# EAGLE design Tach-to-CAN (EAGLE 9.5.1)
COMPANY_HQ: BUFFALO, NY; COMPANY_NAME: PROJECTMX5; PROJECT: MAZDA MIATA TACH TO CAN; SCH_REV: A
Assembly variants: Production

## Sheet 1 of 5: TACHOMETER ISOLATION
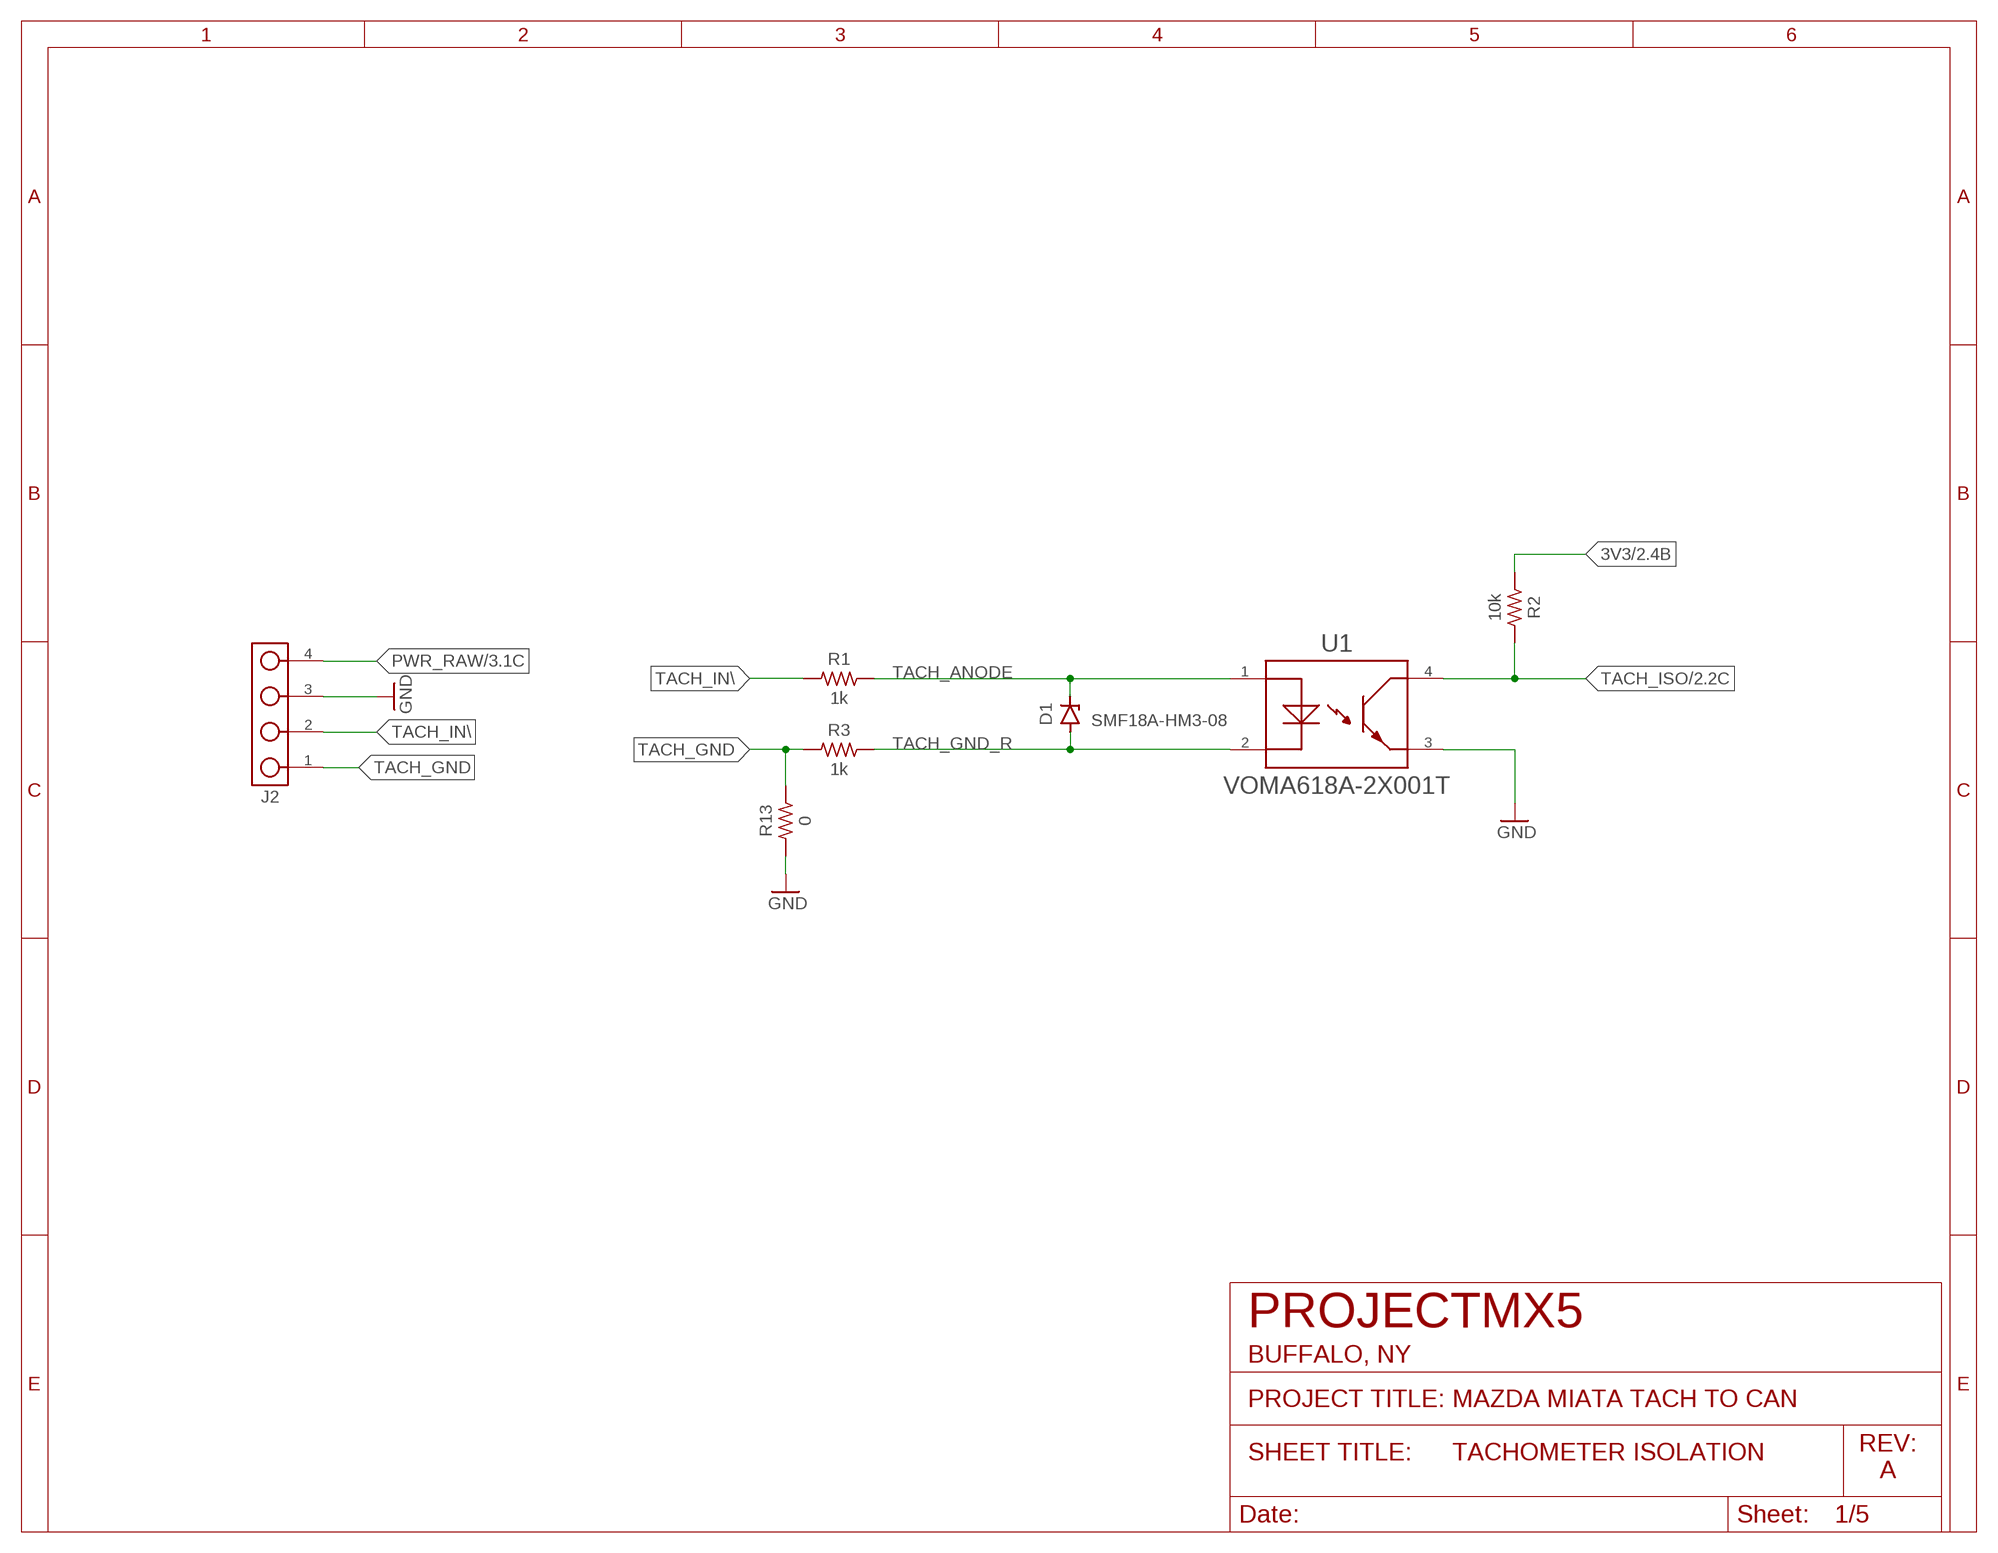
[diagram p0: schematic, sheet 1]

### Parts
D1  VISHAY_SMF18A-HM3-08  [VISHAY_SMFXXA-HM3-08]
J2  CONN_4PIN_VERT  [CONN_100MIL_4_PIN]
R1  1k  1KOHM-0603-1%-1/10W  [REST-0603]
R2  10k  10KOHM-0603-1%-1/10W  [REST-0603]
R3  1k  1KOHM-0603-1%-1/10W  [REST-0603]
R13  0  0OHM-0603-1%-1/10W  [REST-0603]
U1  VISHAY_VOMA618A-2X001T  [VISHAY_SOP-4]

### Nets
3V3: R2.1 ; also sheet 2,3,4,5
GND: J2.3 R13.1 U1.3 ; also sheet 2,3,4,5
PWR_RAW: J2.4 ; also sheet 3,5
TACH_ANODE: D1.C R1.2 U1.1
TACH_GND: J2.1 R3.1 R13.2
TACH_GND_R: D1.A R3.2 U1.2
TACH_IN\: J2.2 R1.1
TACH_ISO: R2.2 U1.4 ; also sheet 2

## Sheet 2 of 5: SIGNAL CONDITIONING
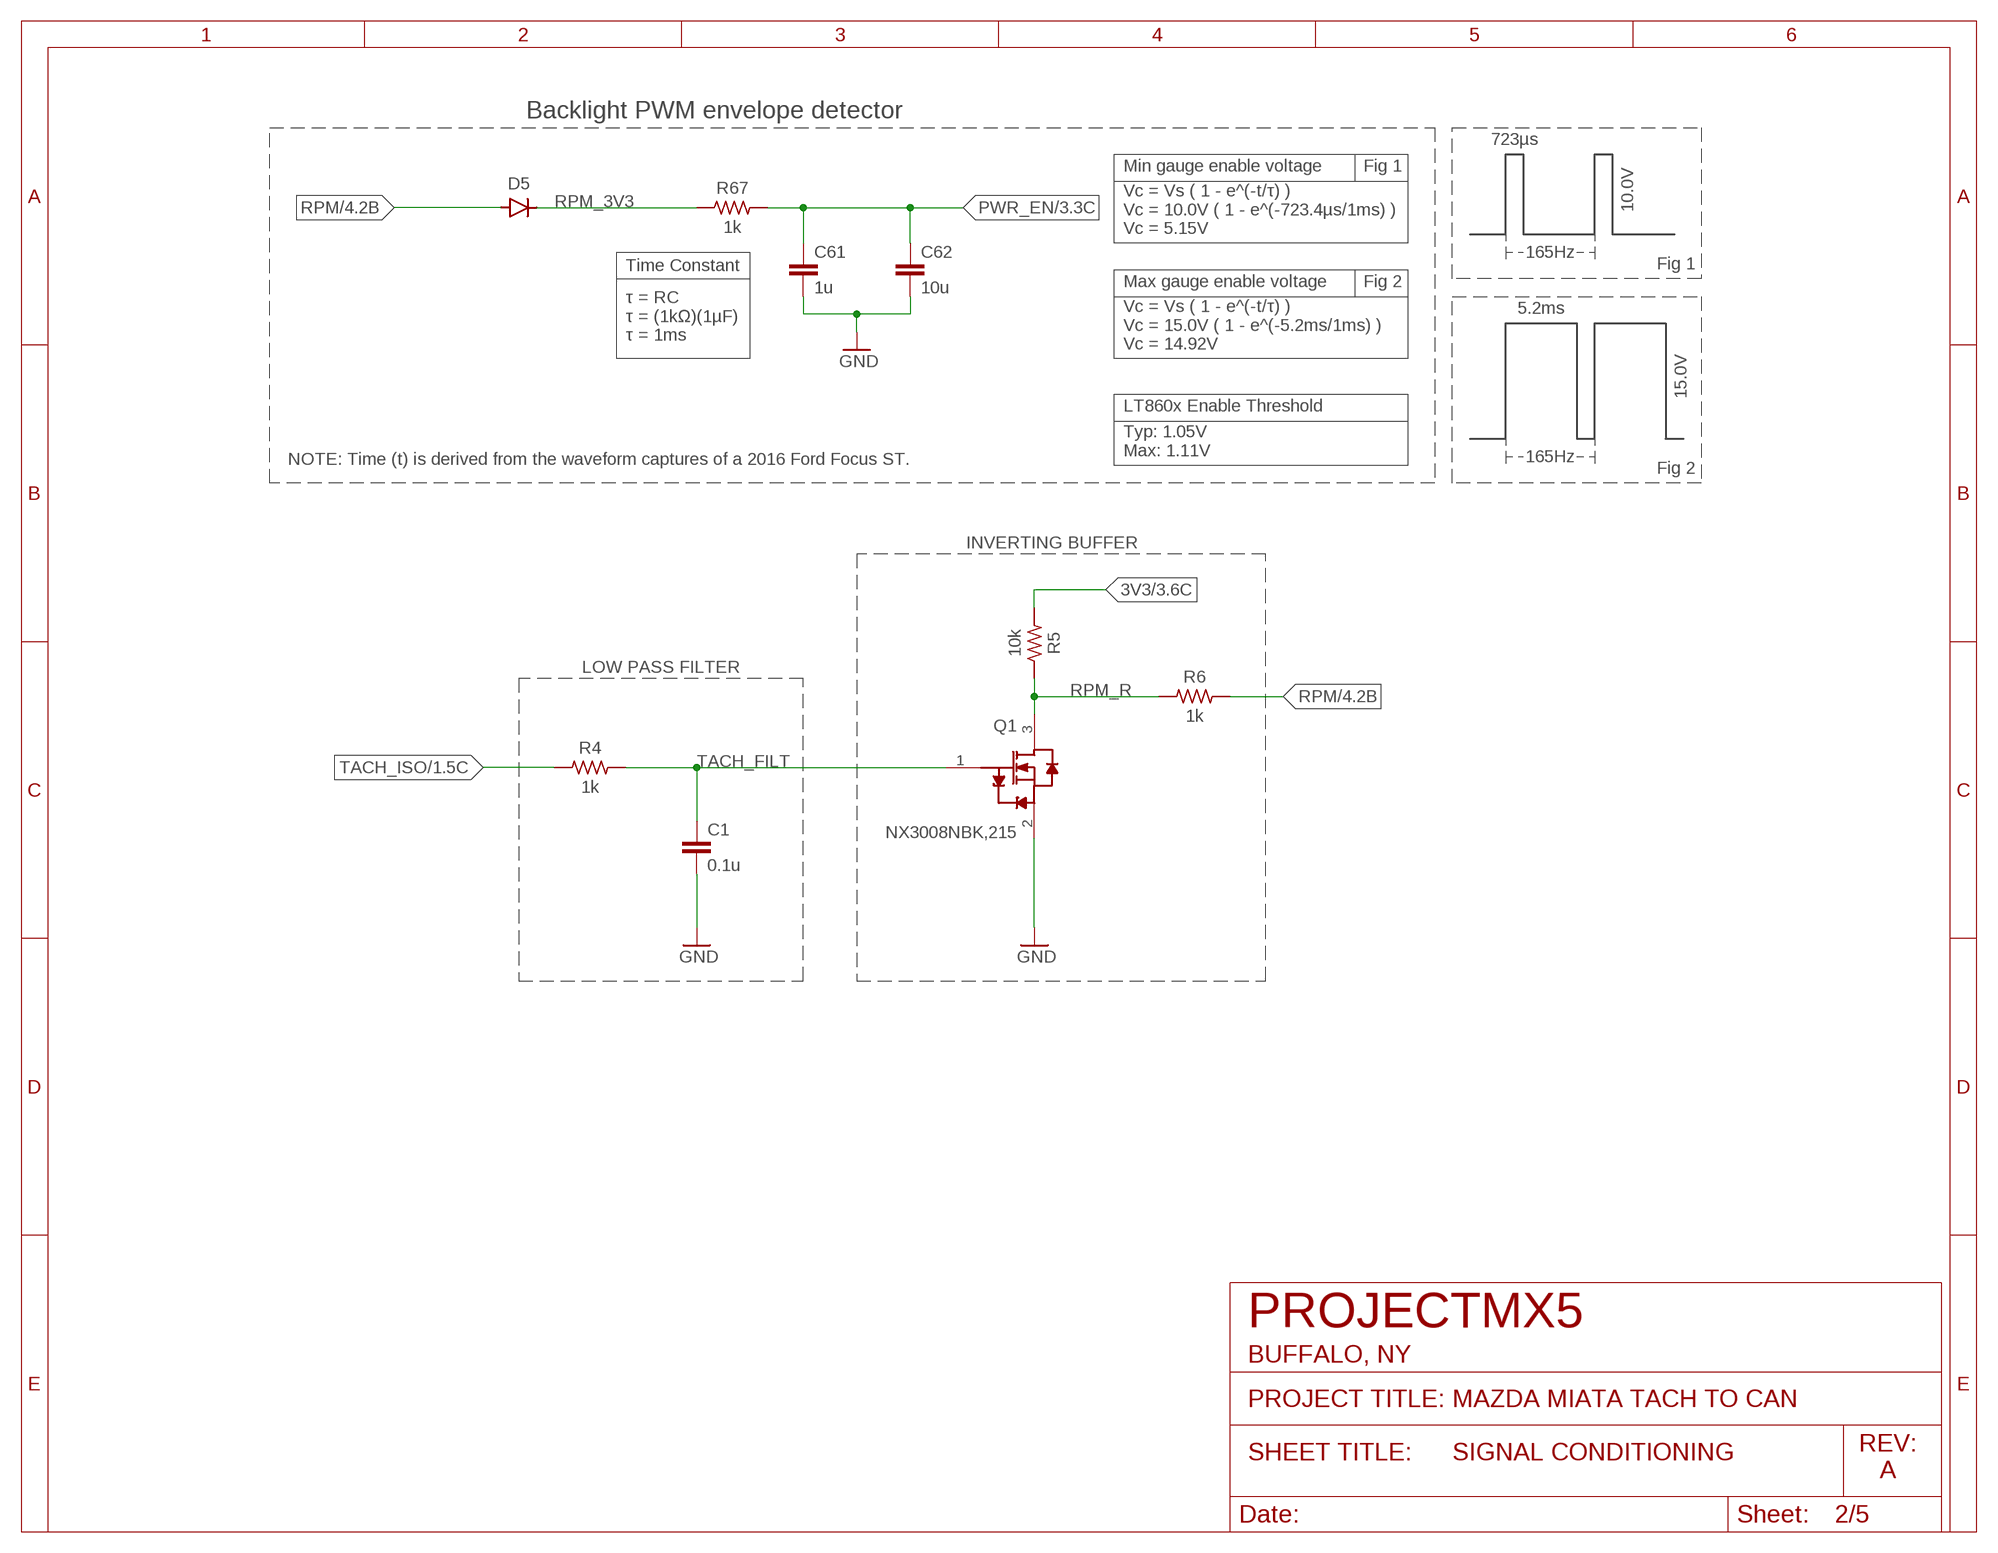
[diagram p1: schematic, sheet 2]

### Parts
C1  0.1u  0.1UF-X7R-50V-20%  [CAP-0603]
C61  1u  1UF-X7R-50V-10%  [CAP-0805]
C62  10u  10UF-X7R-50V-10%  [CAP-1206]  (not fitted in variant Production)
D5  AVX_SD1206S040S2R0  [AVX_SD1206S040S2R0]
Q1  NXP_NX3008NBK,215NXP_SOT23  [NXP_SOT23]
R4  1k  1KOHM-0603-1%-1/10W  [REST-0603]
R5  10k  10KOHM-0603-1%-1/10W  [REST-0603]
R6  1k  1KOHM-0603-1%-1/10W  [REST-0603]
R67  1k  1KOHM-0603-1%-1/10W  [REST-0603]

### Nets
3V3: R5.1 ; also sheet 1,3,4,5
GND: C1.2 C61.2 C62.2 Q1.2(S) ; also sheet 1,3,4,5
PWR_EN: C61.1 C62.1 R67.2 ; also sheet 3
RPM: D5.A R6.2 ; also sheet 4
RPM_3V3: D5.C R67.1
RPM_R: Q1.3(D) R5.2 R6.1
TACH_FILT: C1.1 Q1.1(G) R4.2
TACH_ISO: R4.1 ; also sheet 1

### Notes on the sheet
- Backlight PWM envelope detector
- 723µs
- Min gauge enable voltage | Fig 1
- 10.0V
- Vc = Vs ( 1 - e^(-t/τ) )
  Vc = 10.0V ( 1 - e^(-723.4µs/1ms) )
  Vc = 5.15V
- 165Hz
- Time Constant | Fig 1
- Max gauge enable voltage | Fig 2
- 5.2ms
- τ = RC
  τ = (1kΩ)(1µF)
  τ = 1ms
- Vc = Vs ( 1 - e^(-t/τ) )
  Vc = 15.0V ( 1 - e^(-5.2ms/1ms) )
  Vc = 14.92V
- 15.0V
- LT860x Enable Threshold
- Typ: 1.05V
  Max: 1.11V
- 165Hz
- NOTE: Time (t) is derived from the waveform captures of a 2016 Ford Focus ST.
- Fig 2
- INVERTING BUFFER
- LOW PASS FILTER

## Sheet 3 of 5: POWER
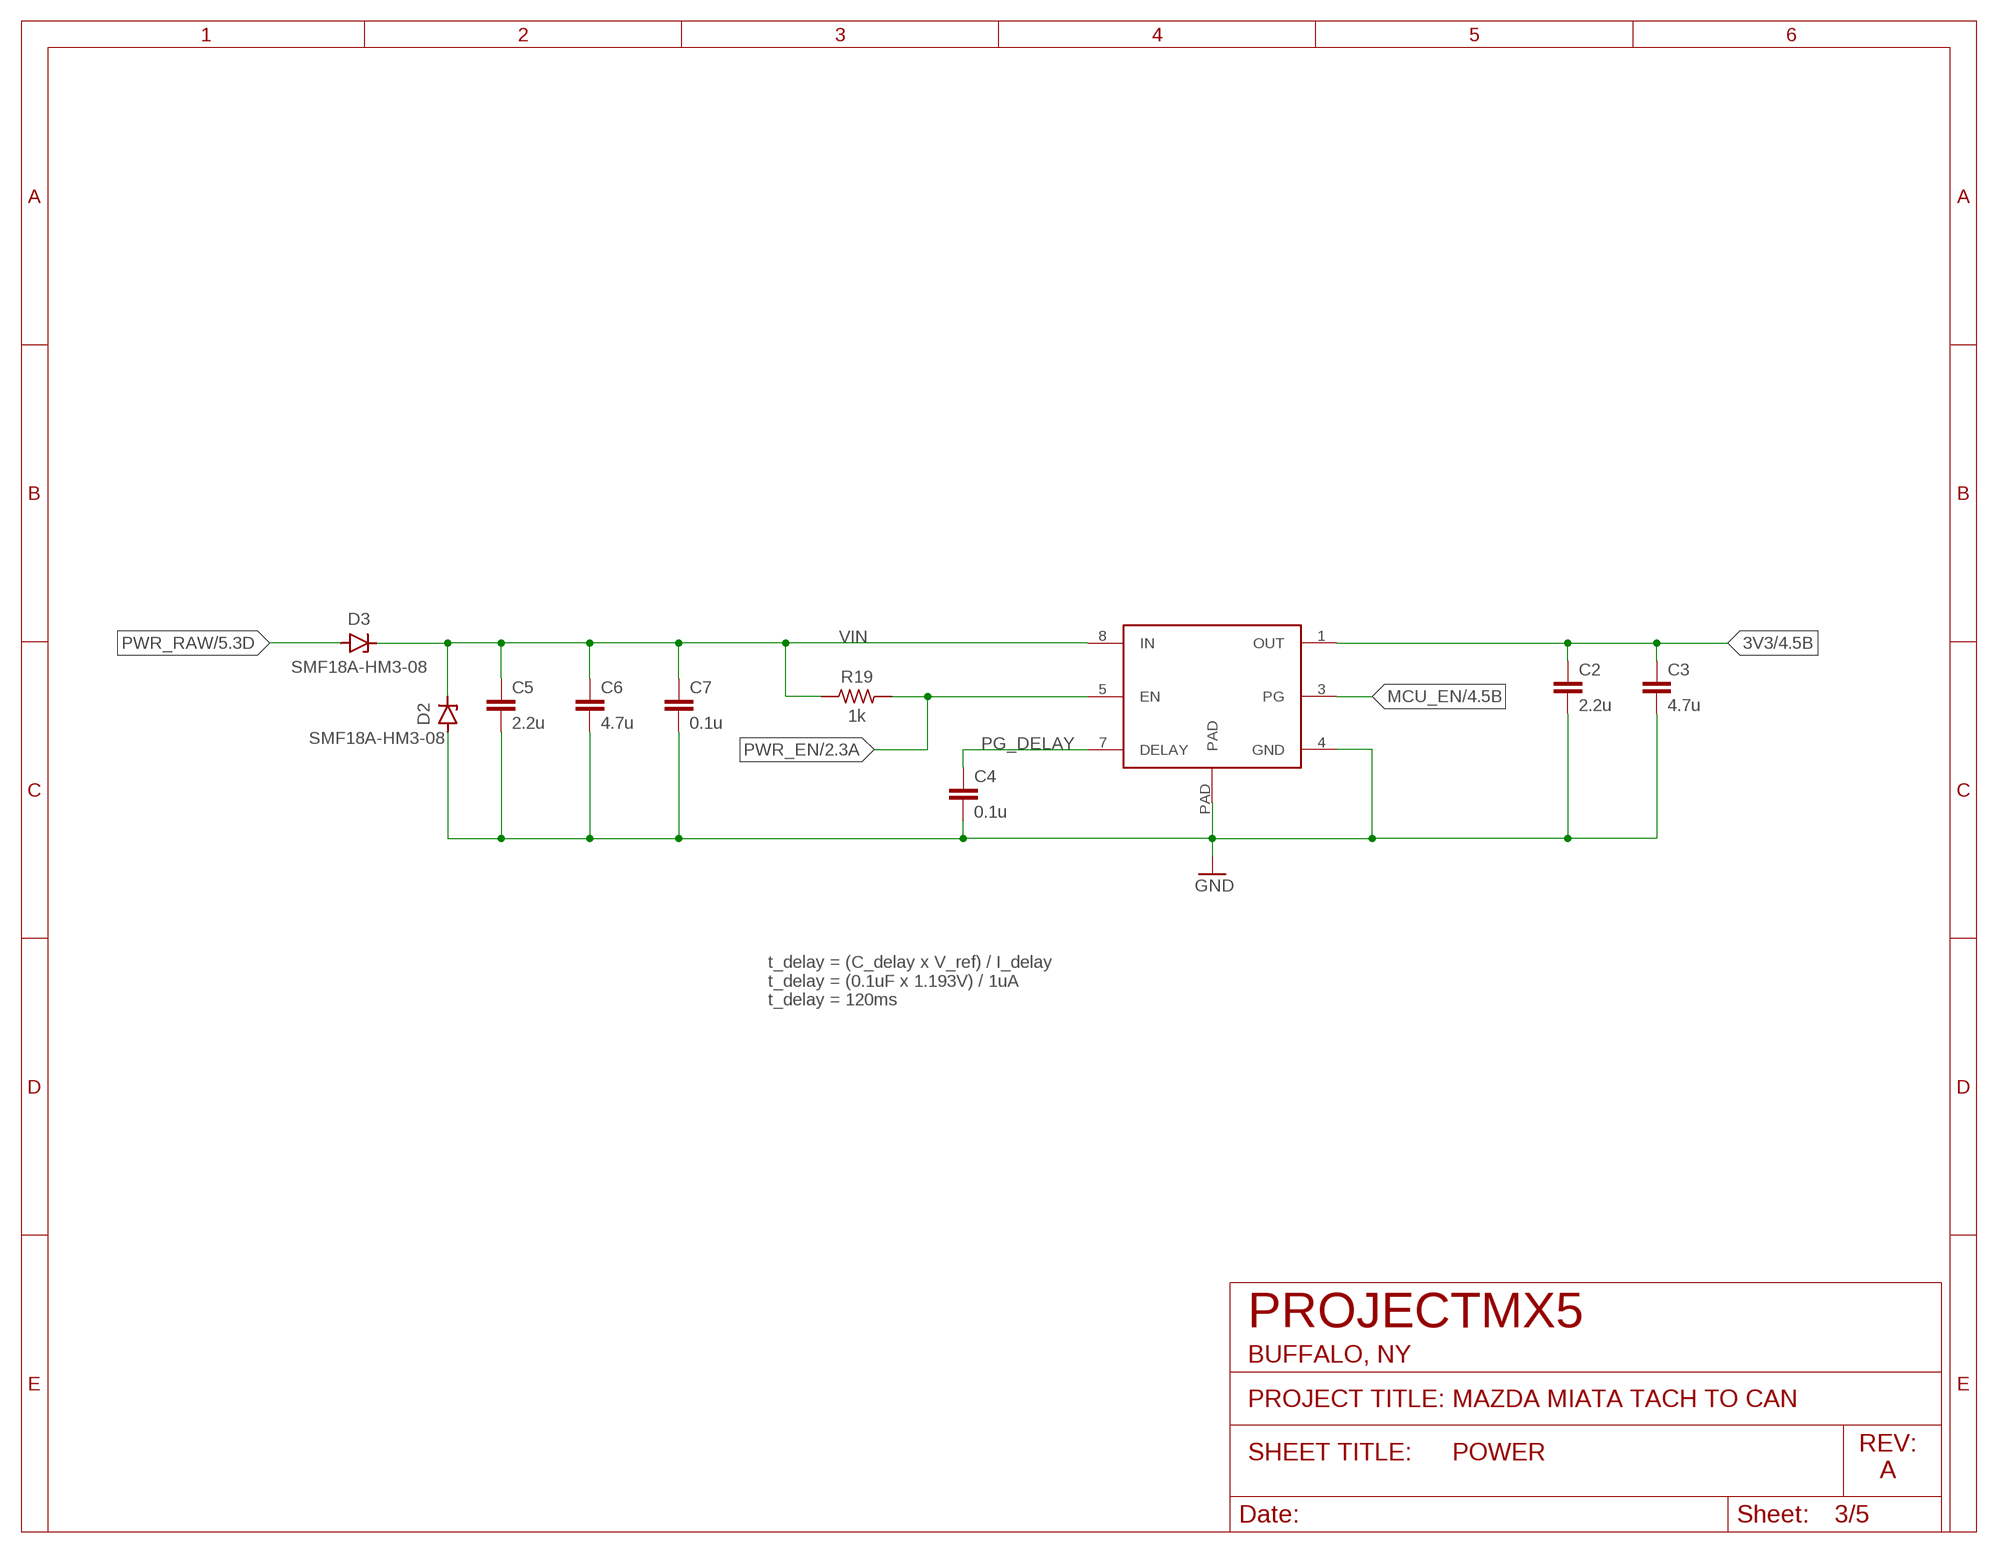
[diagram p2: schematic, sheet 3]

### Parts
C2  2.2u  2.2UF-X7R-25V-10%  [CAP-0805]
C3  4.7u  4.7UF-X7R-50V-10%  [CAP-1206]
C4  0.1u  0.1UF-X7R-50V-20%  [CAP-0603]
C5  2.2u  2.2UF-X7R-25V-10%  [CAP-0805]
C6  4.7u  4.7UF-X7R-50V-10%  [CAP-1206]
C7  0.1u  0.1UF-X7R-50V-20%  [CAP-0603]
D2  VISHAY_SMF18A-HM3-08  [VISHAY_SMFXXA-HM3-08]
D3  VISHAY_SMF18A-HM3-08  [VISHAY_SMFXXA-HM3-08]
R19  1k  1KOHM-0603-1%-1/10W  [REST-0603]
U3  TI_TPS7A1633AQDGNRQ1  [TI_MSSOP8]

### Nets
3V3: C2.1 C3.1 U3.1(OUT) ; also sheet 1,2,4,5
GND: C2.2 C3.2 C4.2 C5.2 C6.2 C7.2 D2.A U3.4(GND) U3.PAD ; also sheet 1,2,4,5
MCU_EN: U3.3(PG) ; also sheet 4
PG_DELAY: C4.1 U3.7(DELAY)
PWR_EN: R19.2 U3.5(EN) ; also sheet 2
PWR_RAW: D3.A ; also sheet 1,5
VIN: C5.1 C6.1 C7.1 D2.C D3.C R19.1 U3.8(IN)

### Notes on the sheet
- t_delay = (C_delay x V_ref) / I_delay
  t_delay = (0.1uF x 1.193V) / 1uA
  t_delay = 120ms

## Sheet 4 of 5: MICROCONTROLLER
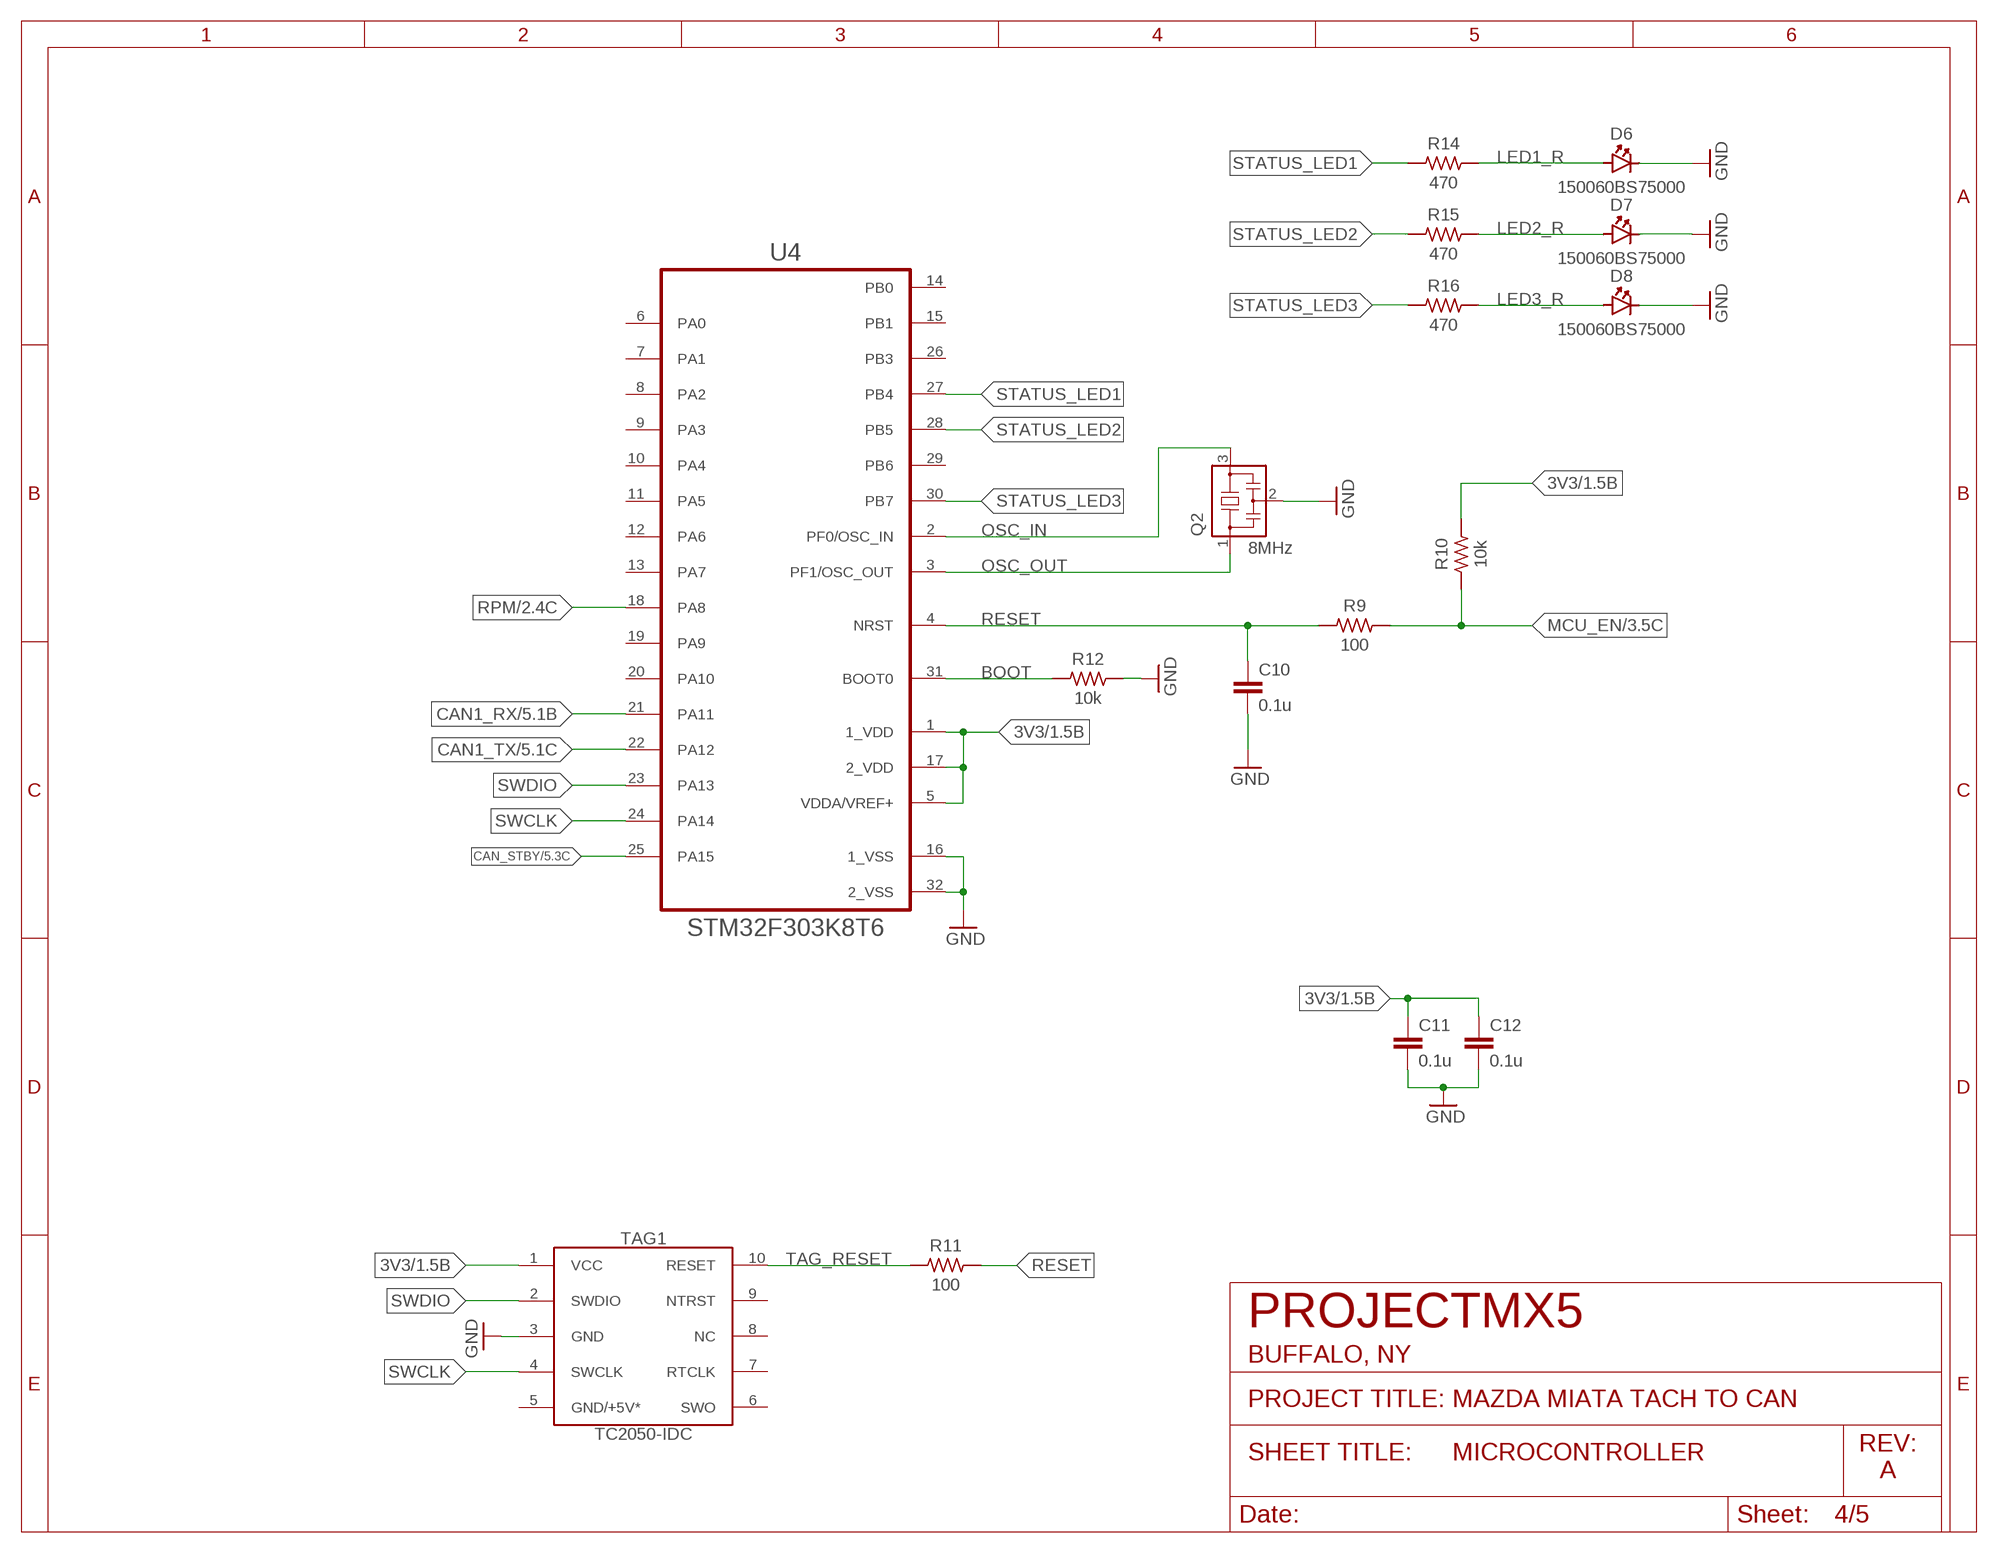
[diagram p3: schematic, sheet 4]

### Parts
C10  0.1u  0.1UF-X7R-50V-20%  [CAP-0603]
C11  0.1u  0.1UF-X7R-50V-20%  [CAP-0603]
C12  0.1u  0.1UF-X7R-50V-20%  [CAP-0603]
D6  LED_BLUE_0603_WURTH  [WURTH_0603_LED]
D7  LED_BLUE_0603_WURTH  [WURTH_0603_LED]
D8  LED_BLUE_0603_WURTH  [WURTH_0603_LED]
Q2  8MHz  CSTNE8M00GH5C000R0  [CSTCR6M]
R9  100  100OHM-0603-1%-1/10W  [REST-0603]
R10  10k  10KOHM-0603-1%-1/10W  [REST-0603]
R11  100  100OHM-0603-1%-1/10W  [REST-0603]
R12  10k  10KOHM-0603-1%-1/10W  [REST-0603]
R14  470  470OHM-0603-1%-1/10W  [REST-0603]
R15  470  470OHM-0603-1%-1/10W  [REST-0603]
R16  470  470OHM-0603-1%-1/10W  [REST-0603]
TAG1  TC2050-IDC  [TC2050-IDC]
U4  STM32F303K8T6STMICROELECTRONICS_STM32F303K8T6  [STM32F303K8T6]

### Nets
3V3: C11.1 C12.1 R10.2 TAG1.1(VCC) U4.1(1_VDD) U4.5(VDDA/VREF+) U4.17(2_VDD) ; also sheet 1,2,3,5
BOOT: R12.1 U4.31(BOOT0)
CAN1_RX: U4.21(PA11) ; also sheet 5
CAN1_TX: U4.22(PA12) ; also sheet 5
CAN_STBY: U4.25(PA15) ; also sheet 5
GND: C10.2 C11.2 C12.2 D6.C D7.C D8.C Q2.2 R12.2 TAG1.3(GND) U4.16(1_VSS) U4.32(2_VSS) ; also sheet 1,2,3,5
LED1_R: D6.A R14.2
LED2_R: D7.A R15.2
LED3_R: D8.A R16.2
MCU_EN: R9.2 R10.1 ; also sheet 3
OSC_IN: Q2.3 U4.2(PF0/OSC_IN)
OSC_OUT: Q2.1 U4.3(PF1/OSC_OUT)
RESET: C10.1 R9.1 R11.2 U4.4(NRST)
RPM: U4.18(PA8) ; also sheet 2
STATUS_LED1: R14.1 U4.27(PB4)
STATUS_LED2: R15.1 U4.28(PB5)
STATUS_LED3: R16.1 U4.30(PB7)
SWCLK: TAG1.4(SWCLK) U4.24(PA14)
SWDIO: TAG1.2(SWDIO) U4.23(PA13)
TAG_RESET: R11.1 TAG1.10(RESET)
Unconnected: TAG1.5(GND/+5V*) TAG1.6(SWO) TAG1.7(RTCLK) TAG1.8(NC) TAG1.9(NTRST) U4.6(PA0) U4.7(PA1) U4.8(PA2) U4.9(PA3) U4.10(PA4) U4.11(PA5) U4.12(PA6) U4.13(PA7) U4.14(PB0) U4.15(PB1) U4.19(PA9) U4.20(PA10) U4.26(PB3) U4.29(PB6)

## Sheet 5 of 5: CAN BUS
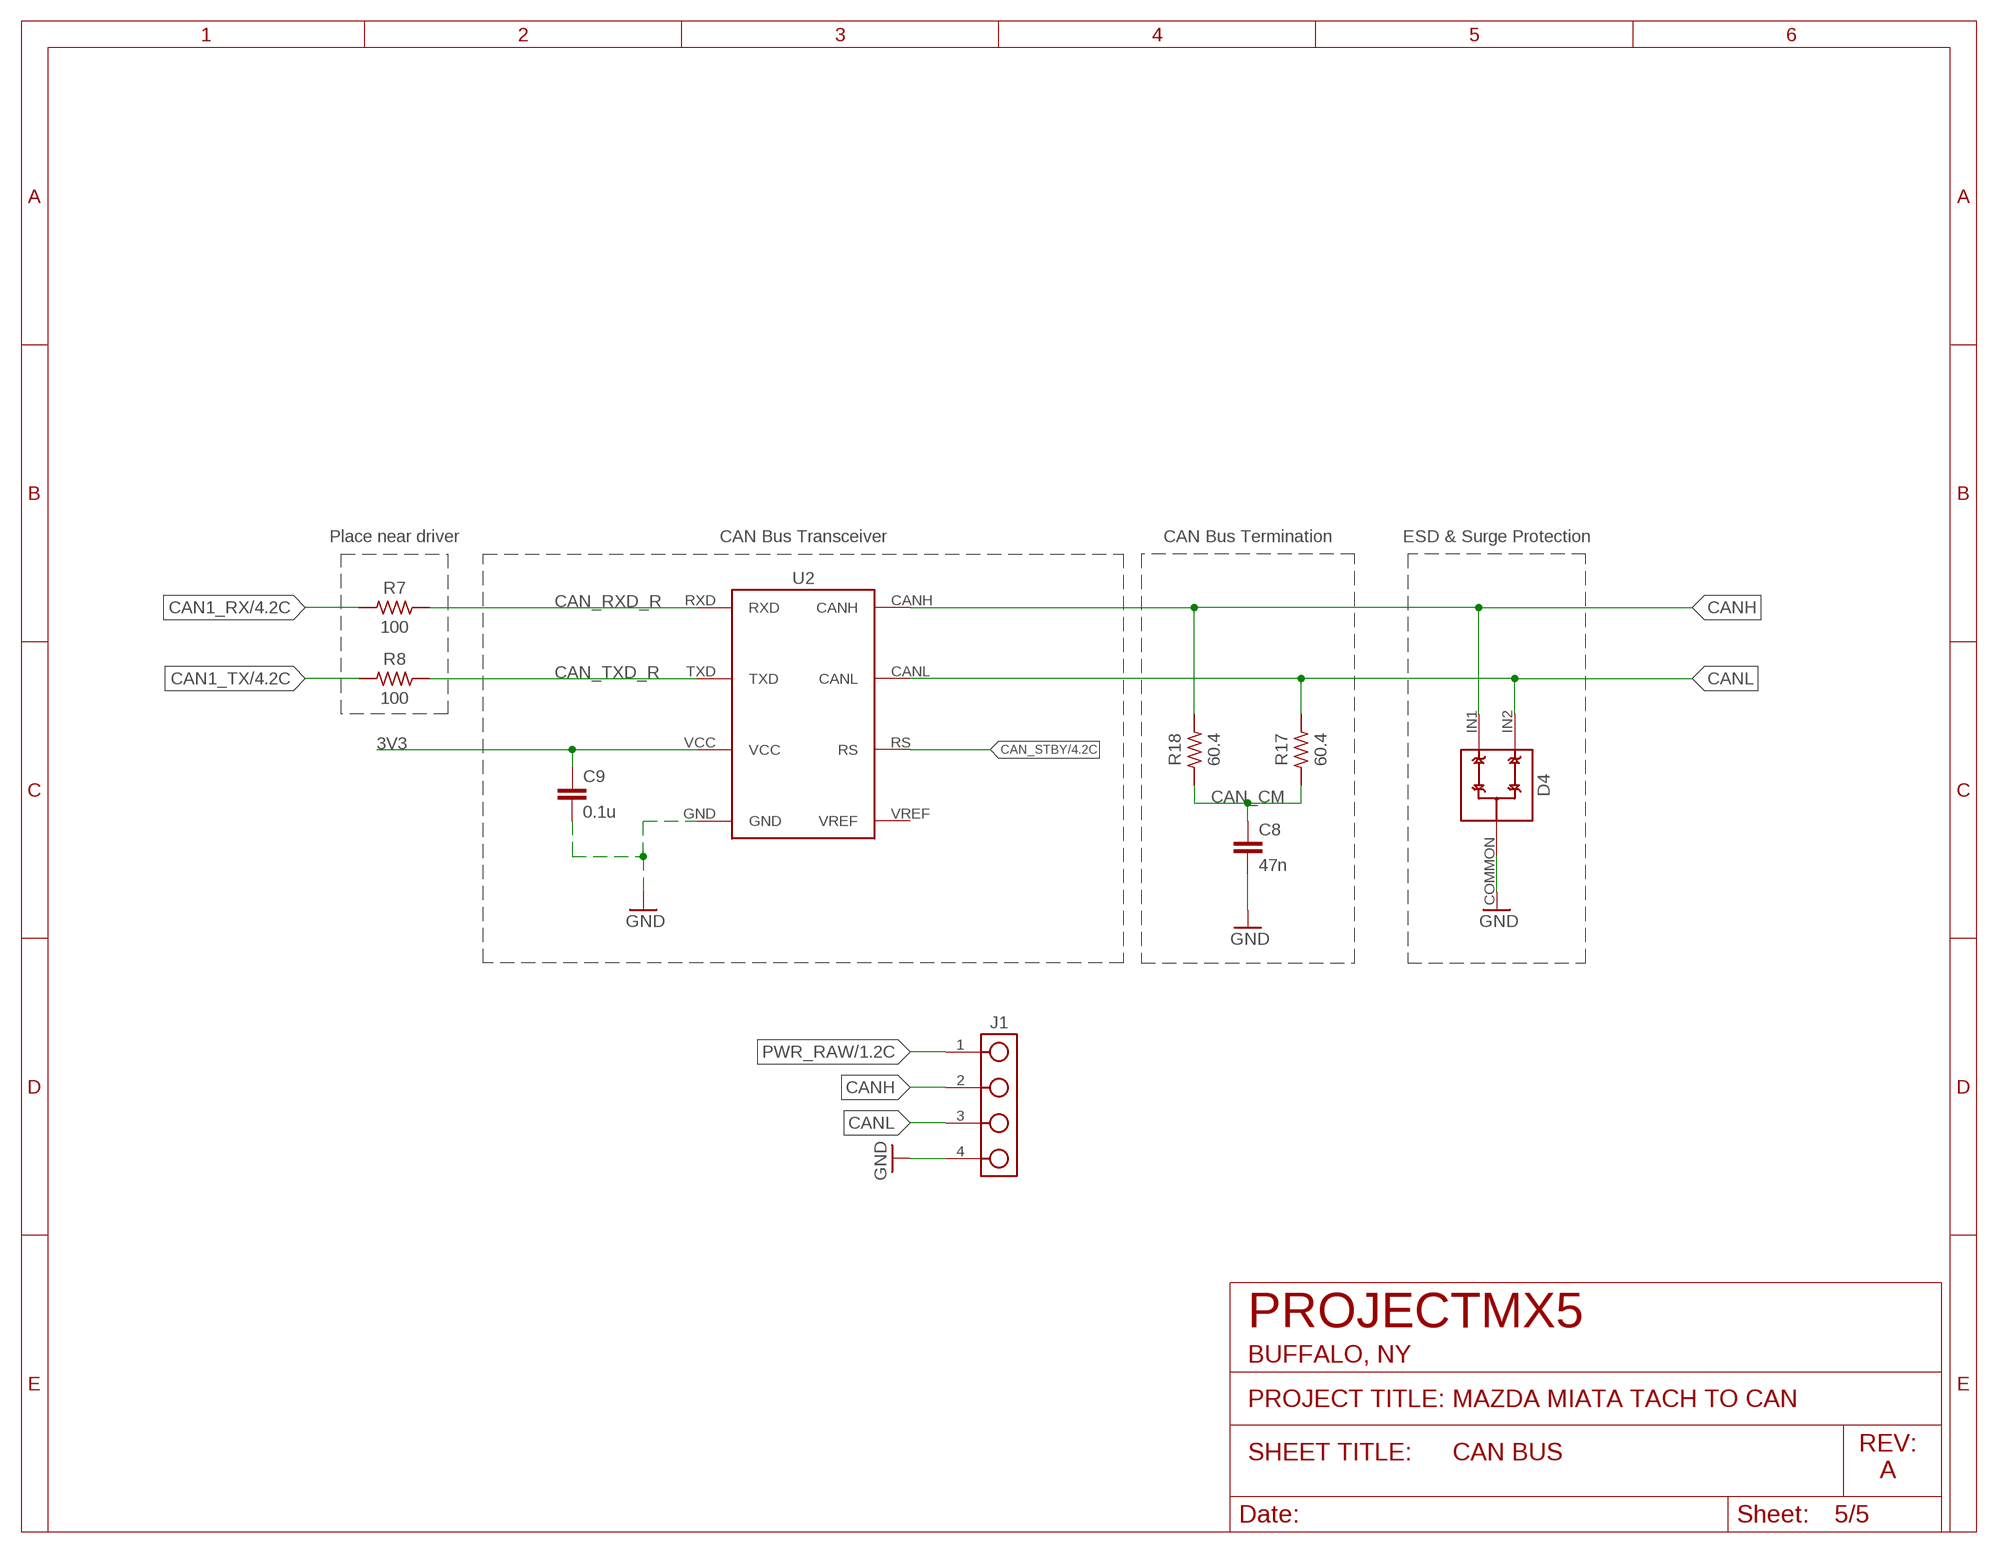
[diagram p4: schematic, sheet 5]

### Parts
C8  47n  47NF-X7R-50V-10%  [CAP-0603]  (not fitted in variant Production)
C9  0.1u  0.1UF-X7R-50V-20%  [CAP-0603]
D4  CDSOT23-T24CAN-Q  BOURNS_CDSOT23-T24CAN-Q  [BOURNS_CDSOT23-T24CAN-Q]
J1  CONN_4PIN_VERT  [CONN_100MIL_4_PIN]
R7  100  100OHM-0603-1%-1/10W  [REST-0603]
R8  100  100OHM-0603-1%-1/10W  [REST-0603]
R17  60.4  60.4OHM-0603-1%-1/10W  [REST-0603]  (not fitted in variant Production)
R18  60.4  60.4OHM-0603-1%-1/10W  [REST-0603]  (not fitted in variant Production)
U2  TI_SN65HVD23X  [TI_SN65HVD23X]

### Nets
3V3: C9.1 U2.VCC ; also sheet 1,2,3,4
CAN1_RX: R7.1 ; also sheet 4
CAN1_TX: R8.1 ; also sheet 4
CAN_CM: C8.1 R17.1 R18.1
CAN_RXD_R: R7.2 U2.RXD
CAN_STBY: U2.RS ; also sheet 4
CAN_TXD_R: R8.2 U2.TXD
CANH: D4.IN1(IN2) J1.2 R18.2 U2.CANH
CANL: D4.IN2(IN1) J1.3 R17.2 U2.CANL
GND: C8.2 C9.2 D4.COMMON(OUT) J1.4 U2.GND ; also sheet 1,2,3,4
PWR_RAW: J1.1 ; also sheet 1,3
Unconnected: U2.VREF

### Notes on the sheet
- Place near driver | CAN Bus Transceiver | CAN Bus Termination | ESD & Surge Protection

## Library data of the parts
C1 C4 C7 C9-C12 = capacitors:0.1UF: CAPACITOR; MFG: KEMET; MNT: SMD; PINS: 2; PKG: 0603; PN: C0603C104M5RACTU
C2 C5 = capacitors:2.2UF: CAPACITOR; MFG: AVX; MNT: SMD; PINS: 2; PKG: SMD; PN: 08053C225K4T2A
C3 C6 = capacitors:4.7UF: CAPACITOR; MFG: KEMET; MNT: SMD; PINS: 2; PKG: 1206; PN: C1206C475K5RACAUTO
C8 = capacitors:47NF: CAPACITOR; MFG: TDK; MNT: SMD; PINS: 2; PKG: 0603; PN: C1608X7R1H473K080AE
C61 = capacitors:1UF: CAPACITOR; MFG: TAIYO YUDEN; MNT: SMD; PINS: 2; PKG: SMD; PN: UMF212B7105KGHT
C62 = capacitors:10UF: CAPACITOR; MFG: TDK; MNT: SMD; PINS: 2; PKG: 1206; PN: CGA5L1X7R1H106K160AC
D1-D3 = AlphaLibrary:VISHAY_SMF18A-HM3-08; MFG: VISHAY; MNT: SMD; PINS: 2; PKG: DO-219AB-2; PN: SMF18A-HM3-08
D4 = AlphaLibrary:BOURNS_CDSOT23-T24CAN-Q: ESD and surge protection for CAN transceivers; MFG: BOURNS; MNT: SMD; PINS: 3; PKG: SOT23-3; PN: CDSOT23-T24CAN-Q
D5 = AlphaLibrary:AVX_SD1206S040S2R0: DIODE SCHOTTKY 40V 2A 1206; MFG: AVX; MNT: SMD; PINS: 2; PKG: 1206; PN: SD1206S040S2R0
D6-D8 = AlphaLibrary:LED_BLUE_0603_WURTH: STANDARD LED, BLUE, 0603; MFG: WURTH ELEKTRONIK; MNT: SMD; PINS: 2; PKG: 0603; PN: 150060BS75000
J1 J2 = AlphaLibrary:CONN_4PIN_VERT
Q1 = AlphaLibrary:NXP_NX3008NBK,215: NXP-NMOS-GSD-3; MFG: NXP; MNT: SMD; PINS: 3; PKG: SOT23-3; PN: NX3008NBK,215
Q2 = AlphaLibrary:CSTNE8M00GH5C000R0: CERAMIC RES 8.0000MHZ 33PF SMD; MFG: MURATA; MNT: SMD; PINS: 3; PKG: 3-SMD; PN: CSTNE8M00GH5C000R0
R1 R3 R4 R6 R19 R67 = resistors:1KOHM: RESISTOR; MFG: VISHAY; MNT: SMD; PINS: 2; PKG: 0603; PN: CRCW06031K00FKEA
R2 R5 R10 R12 = resistors:10KOHM: RESISTOR; MFG: VISHAY; MNT: SMD; PINS: 2; PKG: 0603; PN: CRCW060310K0FKEA
R7-R9 R11 = resistors:100OHM: RESISTOR; MFG: VISHAY; MNT: SMD; PINS: 2; PKG: 0603; PN: CRCW0603100KFKEA
R13 = resistors:0OHM: RESISTOR; MFG: VISHAY; MNT: SMD; PINS: 2; PKG: 0603; PN: CRCW06030000Z0EA
R14-R16 = resistors:470OHM: RESISTOR; MFG: PANASONIC; MNT: SMD; PINS: 2; PKG: 0603; PN: ERJ-3EKF4700V
R17 R18 = resistors:60.4OHM: RESISTOR; MFG: KOA; MNT: SMD; PINS: 2; PKG: 0603; PN: RK73H1JTTD60R4F
TAG1 = AlphaLibrary:TC2050-IDC: Tag Connect 2050 IDC; MFG: TAG-CONNECT; PN: TC2050-IDC
U1 = AlphaLibrary:VISHAY_VOMA618A-2X001T: OPTOCOUPLER, AEC-Q101, 3.75KV, SOP-4; MFG: VISHAY; MNT: SMD; PINS: 4; PKG: SOP-4; PN: VOMA618A-2X001T; SPICEPREFIX: E
U2 = AlphaLibrary:TI_SN65HVD23X: 3.3V CAN Bus TRANSCEIVER; MANUFACTURER: TEXAS INSTRUMENTS; PARTNUMBER: SN65HVD232QDRQ1; PINS: 8
U3 = AlphaLibrary:TI_TPS7A1633AQDGNRQ1: LDO Voltage Regulators Automotive 60-V, 5--A IQ, 100-mA low-dropout (LDO) voltage regulator with enable and power good 8-MSOP-PowerPAD -40 to 125; MFG: TI; MNT: SMD; PINS: 9; PKG: MSSOP-8; PN: TPS7A1633AQDGNRQ1
U4 = AlphaLibrary:STM32F303K8T6: MC-ARM-STM32F303-LQFP32; MANUFACTURER: STMICROELECTRONICS; PARTNUMBER: STM32F303K8T6

## Board
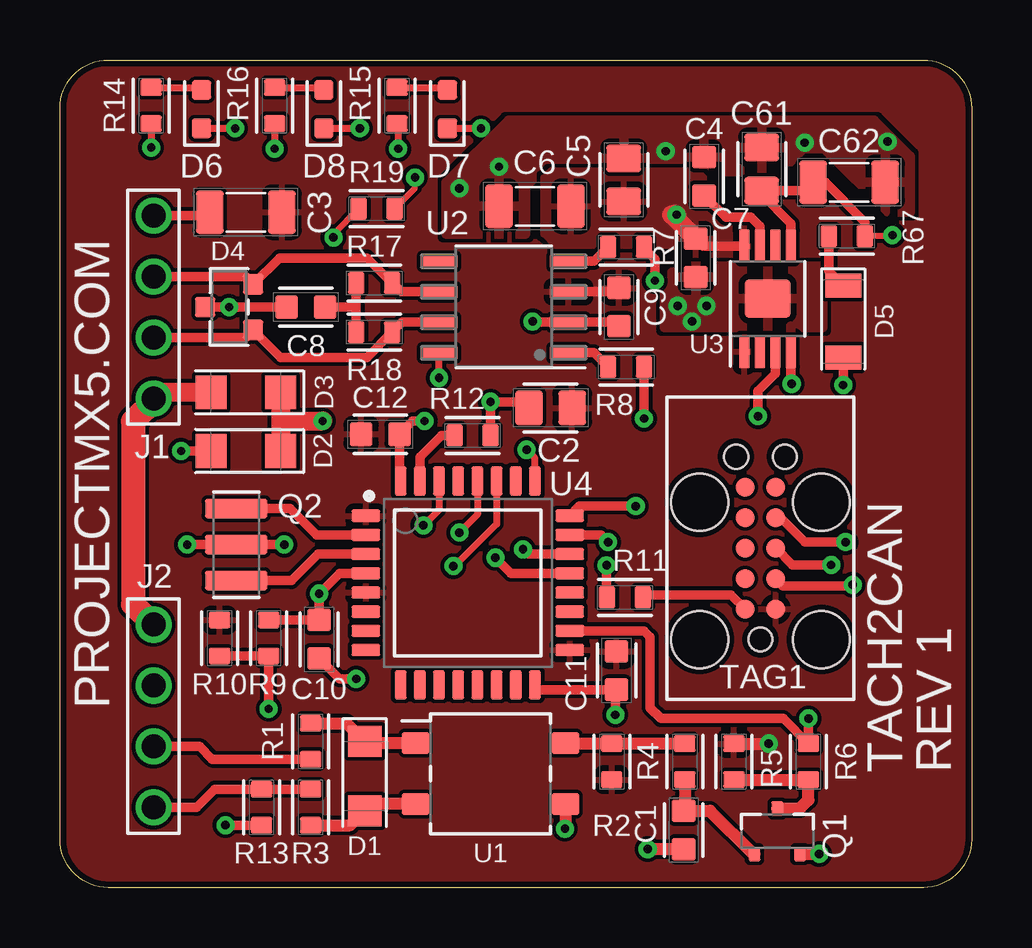
[diagram p5: board, top side]
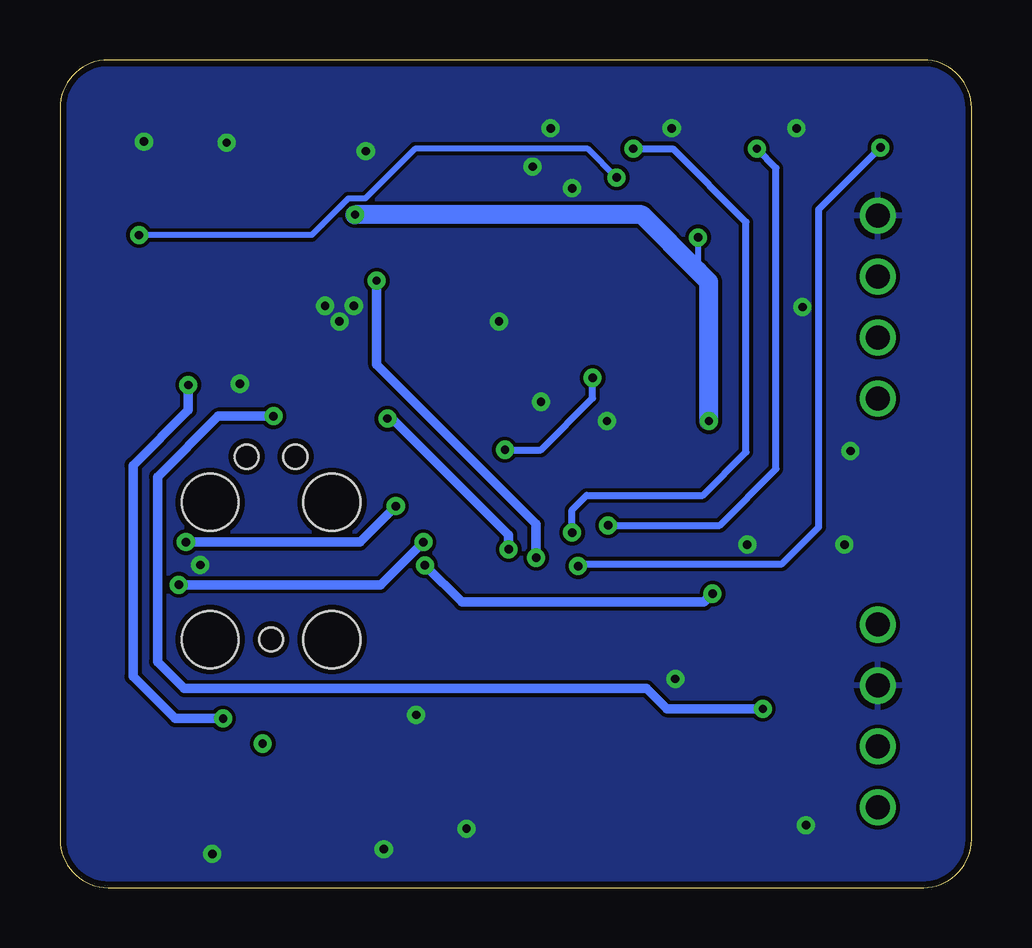
[diagram p6: board, bottom side, seen from below]

Size 38 x 34.5 mm. Coordinates in mm from the lower left corner, seen from the top.
Outline: 2,34.5 36,34.5 arc-90 38,32.5 38,2 arc-90 36,0 2,0 arc-90 0,2 0,32.5 arc-90 2,34.5
Copper layers (1*16): Top 0.035mm / dielectric 1.5mm / Bottom 0.035mm
Design rules "default *": minimum track width 6mil, minimum drill 0.35mm, track to track 6mil, track to pad 6mil, pad to pad 6mil, via to via 6mil, smd to smd 6mil, copper to edge 10mil, drill to drill 6mil, minimum pad ring 10mil, minimum via ring 8mil, stop-mask expansion 4mil, vias tented up to drill 0mil, thermal gap 10mil

### Footprints (pad centres in the part's own frame; a part is rotated, then mirrored left to right if it is on the bottom)
CAP-0603 = smd 0.95 x 1: 1 -0.8,0; 2 0.8,0
CAP-0805 = smd 1.15 x 1.45: 1 -0.9,0; 2 0.9,0
CAP-1206 = smd 1.15 x 1.8: 1 -1.5,0; 2 1.5,0
VISHAY_SMFXXA-HM3-08 = smd 1.3 x 1.4: A -1.45,0; C 1.45,0
BOURNS_CDSOT23-T24CAN-Q = smd 0.85 x 0.85: COMMON 1,0; IN1 -1,0.95; IN2 -1,-0.95
AVX_SD1206S040S2R0 = smd 1 x 1.5: A -1.5,0; C 1.5,0
WURTH_0603_LED = smd 0.8 x 0.8: A 0.8,0; C -0.8,0
CONN_100MIL_4_PIN = drill 1 pad 1.5: 1 -3.81,0; 2 -1.27,0; 3 1.27,0; 4 3.81,0
NXP_SOT23 = smd 0.6 x 0.5: 1 -0.95,0.95; 2 -0.95,-0.95; 3 0.95,0
CSTCR6M = smd 0.8 x 2.6: 1 -1.5,0; 2 0,0; 3 1.5,0
REST-0603 = smd 0.7 x 0.9: 1 -0.75,0; 2 0.75,0
TC2050-IDC = smd 0.787 x 0.787: 1 -2.54,-0.635; 2 -1.27,-0.635; 3 0,-0.635; 4 1.27,-0.635; 5 2.54,-0.635; 6 2.54,0.635; 7 1.27,0.635; 8 0,0.635; 9 -1.27,0.635; 10 -2.54,0.635 | hole 0.991: -3.81,0; 3.81,-1.016; 3.81,1.016 | hole 2.375: -3.81,2.54; -3.81,-2.54; 1.905,-2.54; 1.905,2.54
VISHAY_SOP-4 = smd 1.15 x 0.9: 1 -3.125,1.27; 2 -3.125,-1.27; 3 3.125,-1.27; 4 3.125,1.27
TI_SN65HVD23X = smd 1.55 x 0.6: CANH 2.7,0.635; CANL 2.7,-0.635; GND -2.7,0.635; RS 2.7,1.905; RXD -2.7,-1.905; TXD -2.7,1.905; VCC -2.7,-0.635; VREF 2.7,-1.905
TI_MSSOP8 = smd 1.4 x 0.45: 1 -2.2,0.975; 2 -2.2,0.325; 3 -2.2,-0.325; 4 -2.2,-0.975; 5 2.2,-0.975; 6 2.2,-0.325; 7 2.2,0.325; 8 2.2,0.975 | smd 1.6 x 1.92: PAD 0,0
STM32F303K8T6 = smd 1.2 x 0.5: 1 -4.25,2.8; 2 -4.25,2; 3 -4.25,1.2; 4 -4.25,0.4; 5 -4.25,-0.4; 6 -4.25,-1.2; 7 -4.25,-2; 8 -4.25,-2.8; 17 4.25,-2.8; 18 4.25,-2; 19 4.25,-1.2; 20 4.25,-0.4; 21 4.25,0.4; 22 4.25,1.2; 23 4.25,2; 24 4.25,2.8 | smd 0.5 x 1.2: 9 -2.8,-4.25; 10 -2,-4.25; 11 -1.2,-4.25; 12 -0.4,-4.25; 13 0.4,-4.25; 14 1.2,-4.25; 15 2,-4.25; 16 2.8,-4.25; 25 2.8,4.25; 26 2,4.25; 27 1.2,4.25; 28 0.4,4.25; 29 -0.4,4.25; 30 -1.2,4.25; 31 -2,4.25; 32 -2.8,4.25

### Placement (x,y rotation side)
C1  26,2.4 270 top
C2  20.45,20 180 top
C3  7.75,28.15 180 top
C4  26.85,29.65 90 top
C5  23.5,29.5 90 top
C6  19.8,28.4 180 top
C7  26.5,26.25 270 top
C8  10.25,24.2 180 top
C9  23.3,24.2 270 top
C10  10.8,10.35 270 top
C11  23.2,9.05 270 top
C12  13.35,18.9 0 top
C61  29.25,29.95 90 top
C62  32.9,29.4 0 top
D1  12.7,4.65 90 top
D2  7.75,18.2 0 top
D3  7.75,20.65 0 top
D4  7.05,24.2 180 top
D5  32.65,23.6 90 top
D6  5.9,32.45 90 top
D7  16.15,32.45 90 top
D8  11,32.45 90 top
J1  3.9,24.2 90 top
J2  3.9,7.15 90 top
Q1  29.9,2.35 90 top
Q2  7.35,14.3 90 top
R1  10.45,6.1 90 top
R2  23,5.25 90 top
R3  10.45,3.35 270 top
R4  26.05,5.25 270 top
R5  28.1,5.25 270 top
R6  31.2,5.25 90 top
R7  23.6,26.7 180 top
R8  23.6,21.7 180 top
R9  8.7,10.4 270 top
R10  6.65,10.4 90 top
R11  23.55,12.1 180 top
R12  17.2,18.85 0 top
R13  8.4,3.35 90 top
R14  3.8,32.6 90 top
R15  14.05,32.6 90 top
R16  8.95,32.6 90 top
R17  13.1,25.2 0 top
R18  13.1,23.15 0 top
R19  13.2,28.3 0 top
R67  32.8,27.15 0 top
TAG1  29.2,14.15 90 top
U1  17.95,4.75 0 top
U2  18.5,24.2 180 top
U3  29.5,24.55 90 top
U4  17,12.7 0 top

### Tracks (layer width: path | path; a pad name or v marks a point on that pad's centre or on a via)
3V3  (via drill 0.35)
  Top 0.4: U2.VCC 23.14,24.84 C9.1 | 12.55,15.5 U4.1
  Top 0.5: R5.1 v29.55,6
  pour Top (rank 6): 0,5.85 0,0 22.2,0 38,0 38,19.15 38,34.5 2.35,34.5 0,34.5
BOOT
  Top 0.4: U4.31 15,17.95 15.9,18.85 R12.1
CAN1_RX  (via drill 0.35)
  Top 0.4: U4.21 18.8,13.1 v18.15,13.75 | v24.8,25.3 24.8,26.2 24.35,26.65 R7.1
  Bottom 0.4: v18.15,13.75 18.15,15.15 24.8,21.8 v24.8,25.3
CAN1_TX  (via drill 0.35)
  Top 0.4: U4.22 19.5,13.9 v19.3,14.1 | R8.1 v24.35,19.55
  Bottom 0.4: v19.3,14.1 19.3,14.7 24.15,19.55 v24.35,19.55
CAN_CM
  Top 0.4: R17.1 12.35,24.25 | 12.35,24.25 R18.1 | C8.1 12.3,24.2 12.35,24.25
CAN_RXD_R
  Top 0.4: U2.RXD 22.25,26.11 R7.2
CAN_STBY  (via drill 0.35)
  Top 0.3: U4.25 19.8,17.9 v19.45,18.25 | v15.8,21.25 U2.RS
  Bottom 0.3: v19.45,18.25 17.95,18.25 15.8,20.4 v15.8,21.25
CAN_TXD_R
  Top 0.4: U2.TXD 22.25,22.3 R8.2
CANH
  Top 0.4: U2.CANH 14.27,23.57 R18.2 12.8,22.1 9.2,22.1 D4.IN1 7.73,22.93 J1.2
CANL
  Top 0.4: U2.CANL 14.21,24.84 R17.2 12.8,26.25 9.15,26.25 D4.IN2 7.73,25.47 J1.3
GND  (via drill 0.35)
  Top 0.3: D6.C v7.3,31.65 | D8.C v12.5,31.65 | D7.C v17.55,31.65
  Top 0.4: C9.2 23.14,23.57 U2.GND 19.73,23.57 v19.7,23.6 | C8.2 v7.05,24.2 D4.COMMON | U4.32 14.15,16.95 C12.2 14.7,19.45 v15.2,19.45 | U4.16 19.8,8.25 C11.2 23.15,8.2 v23.15,7.2 | v9.35,14.3 Q2.2 v5.3,14.3 | R12.2 v17.95,20.25 19.3,20.25 C2.2 | v12.35,8.7 11.65,8.7 C10.2 | TAG1.3 30.54,13.45 v32.15,13.45 | R13.1 v6.9,2.6 | D2.A v5.05,18.2 | C3.2 6.11,28.01 J1.4 | U3.4 30.48,21.02 v30.5,21
  Top 0.5: U1.3 21.07,2.48 v21.05,2.45 | C1.2 v24.5,1.6 | Q1.2 v31.65,1.4
  other vias: 25.75,24.25 16.65,29.15 18.3,30.05 25.25,30.7 31.05,31.05 34.5,31.1 26.95,24.25 26.35,23.6
  pour Bottom: 0,13.8 0,34.5 25.2,34.5 38,34.5 38,22.2 38,0 11.45,0 0,0 0,13.75
  pour Top (rank 3): 19.4,27.25 19.4,29.2 20.05,29.85 30.05,29.85 31,30.8 31.85,30.8 34.5,28.15 35.45,28.15 35.45,30.5 33.95,32 18.7,32 16.1,29.4 16.1,27.25
  pour Top: 31.8,25.9 25.75,25.9 25.2,25.35 25.2,23.35 31.8,23.35
LED1_R
  Top 0.3: R14.2 5.8,33.35 D6.A
LED2_R
  Top 0.3: R15.2 16.05,33.35 D7.A
LED3_R
  Top 0.3: R16.2 10.9,33.35 D8.A
MCU_EN  (via drill 0.35)
  Top 0.4: R10.1 R9.2 v8.7,7.45 | U3.3 29.82,21.43 29.1,20.7 v29.1,19.65
  Bottom 0.4: v29.1,19.65 31.4,19.65 33.93,17.12 33.93,9.41 32.82,8.3 13.55,8.3 12.7,7.45 v8.7,7.45
OSC_IN
  Top 0.4: U4.2 10.7,14.7 9.6,15.8 Q2.3
OSC_OUT
  Top 0.4: U4.3 10.75,13.9 9.65,12.8 Q2.1
PG_DELAY
  Top 0.4: U3.7 29.18,27.57 28.8,27.95 27.75,27.95 C4.1
PWR_EN  (via drill 0.35)
  Top 0.25: R19.2 14.8,29.15 v14.8,29.6 | v34.7,27.2 34.65,27.15 R67.2
  Top 0.4: U3.5 30.48,27.68 29.25,28.9 C61.1 31.05,29.05 C62.1 31.9,29.4 33.55,27.75 R67.2
  Bottom 0.25: v14.8,29.6 16,30.8 23.2,30.8 25.27,28.73 25.98,28.73 27.51,27.2 v34.7,27.2
PWR_RAW
  Top 0.8: J1.1 4.16,20.65 D3.A
  Top 1: J2.4 3.05,11.81 3.05,19.44 3.9,20.29 J1.1
RESET  (via drill 0.35)
  Top 0.4: U4.4 11.65,13.1 v10.8,12.25 C10.1 R9.1 | R11.2 22.78,12.12 v22.78,13.43
  Bottom 0.4: v22.78,13.43 21.25,11.9 11.15,11.9 v10.8,12.25
RPM  (via drill 0.35)
  Top 0.4: D5.A v32.65,20.95 | v31.2,7.05 R6.2 30.15,7.05 25.05,7.05 24.6,7.5 24.6,10.45 24.35,10.7 U4.18
  Bottom 0.4: v32.65,20.95 32.65,19.9 34.95,17.6 34.95,8.8 33.2,7.05 v31.2,7.05
RPM_3V3
  Top 0.4: R67.1 32.05,25.7 D5.C
RPM_R
  Top 0.5: R5.2 R6.1 31.2,3.65 30.85,3.3 Q1.3
STATUS_LED1  (via drill 0.35)
  Top 0.3: U4.27 18.2,15.15 16.45,13.4 v16.4,13.4 | R14.1 v3.8,30.85
  Bottom 0.3: v16.4,13.4 16.3,13.5 7.9,13.5 6.37,15.03 6.37,28.28 v3.8,30.85
STATUS_LED2  (via drill 0.35)
  Top 0.3: U4.28 17.4,15.55 v16.65,14.8 | R15.1 14.1,31.8 v14.1,30.8
  Bottom 0.3: v16.65,14.8 16.65,15.75 16.05,16.35 11.2,16.35 9.4,18.15 9.4,27.75 12.45,30.8 v14.1,30.8
STATUS_LED3  (via drill 0.35)
  Top 0.3: U4.30 15.8,15.75 v15.15,15.1 | R16.1 v8.95,30.8
  Bottom 0.3: v15.15,15.1 10.5,15.1 8.15,17.45 8.15,30 v8.95,30.8
SWCLK  (via drill 0.35)
  Top 0.4: TAG1.4 30.03,15.42 31.05,14.4 v32.75,14.4 | v24,15.9 21.65,15.9 U4.24
  Bottom 0.4: v32.75,14.4 25.5,14.4 v24,15.9
SWDIO  (via drill 0.35)
  Top 0.4: U4.23 22.55,14.7 v22.85,14.4 | v33.05,12.62 33.01,12.58 30.14,12.58 TAG1.2
  Bottom 0.4: v22.85,14.4 24.63,12.62 v33.05,12.62
TACH_ANODE
  Top 0.5: R1.2 11.95,6.85 D1.C 12.78,6.02 U1.1
TACH_FILT
  Top 0.5: R4.2 26.05,3.25 C1.1 27.1,3.2 28.9,1.4 Q1.1
TACH_GND
  Top 0.4: R3.1 R13.2 6.45,4.1 5.69,3.34 J2.1
TACH_GND_R
  Top 0.5: R3.2 12.1,2.6 D1.A 12.98,3.48 U1.2
TACH_IN\
  Top 0.4: J2.2 5.82,5.88 6.35,5.35 R1.1
TACH_ISO
  Top 0.5: U1.4 22.98,6.02 R2.2 R4.1
TAG_RESET
  Top 0.4: TAG1.10 27.98,12.2 24.4,12.2 R11.1
VIN  (via drill 0.35)
  Top 0.25: R19.1 11.4,27.25 v11.4,27.1
  Top 0.4: U3.8 26.8,26.75 C7.1
  Top 0.8: D3.C 9.2,19.45 | 9.2,19.45 D2.C | 9.2,19.45 v10.95,19.45 | v25.7,28.05 25.5,28.05 C7.1
  Bottom 0.25: v11.4,27.1 11.4,25.7
  Bottom 0.8: v10.95,19.45 10.95,25.25 11.4,25.7 13.75,28.05 v25.7,28.05
  pour Top (rank 2): 20.15,27.23 20.15,29.6 20.45,29.9 26.55,29.9 28.9,27.55 28.9,26 26.35,26 25.6,26.75 20.63,26.75

### Text on the board
tPlace: PROJECTMX5.COM | TACH2CAN | REV 1